# EAGLE design BackscatterPlantSensor_v6_1 (EAGLE 6.4)

## Sheet 1 of 4
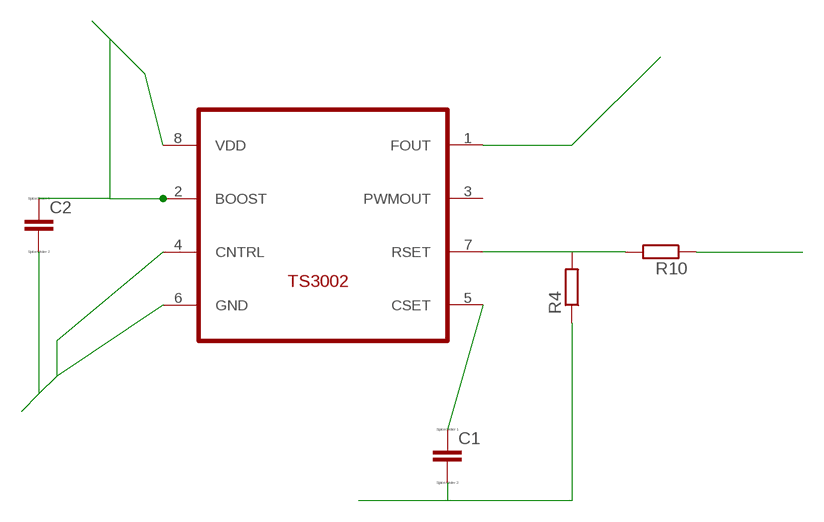
[diagram p0: schematic, sheet 1]

### Parts
C1  CC0603  [C0603]
C2  CC0603  [C0603]
R4  R-EU_R0603  [R0603]
R10  R-EU_R0603  [R0603]
U$1  TS3002  [TDFN22-8]

### Nets
DGND: C1.2 C2.2 R4.1 U$1.4(CNTRL) U$1.6(GND) ; also sheet 3
FOUT: U$1.1(FOUT) ; also sheet 3
N$1: C1.1 U$1.5(CSET)
N$2: R4.2 R10.2 U$1.7(RSET)
VCOND: R10.1 ; also sheet 2
VDD: C2.1 U$1.2(BOOST) U$1.8(VDD) ; also sheet 2,4
Unconnected: U$1.3(PWMOUT)

## Sheet 2 of 4
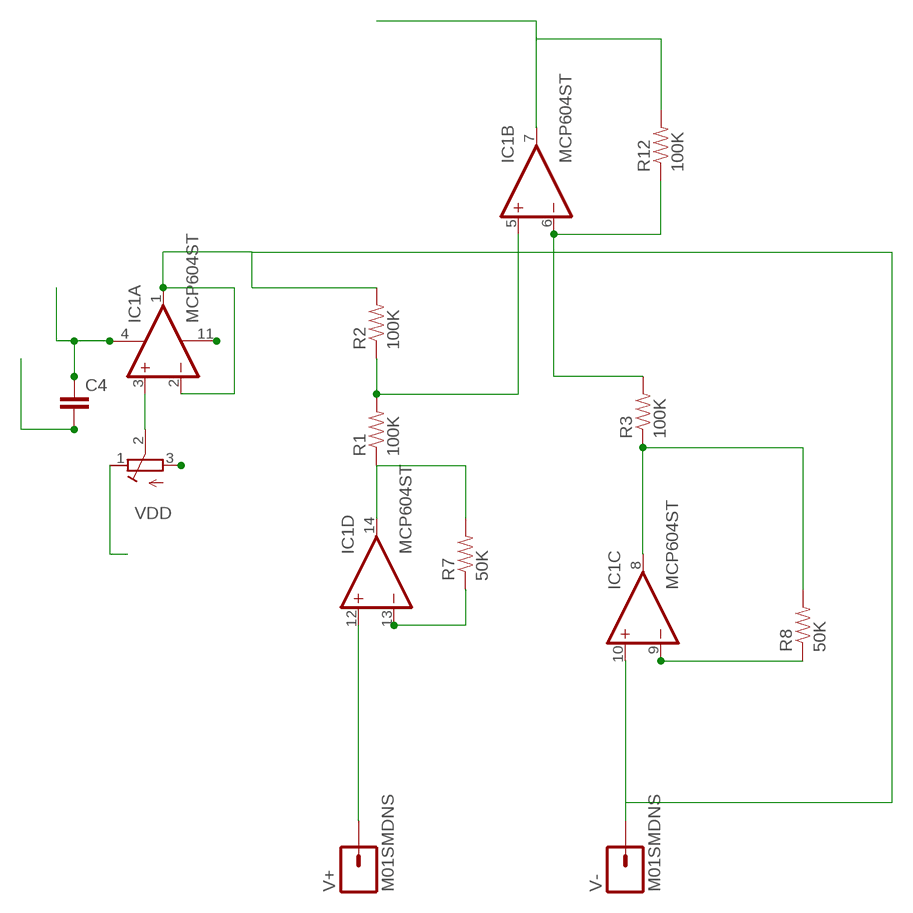
[diagram p1: schematic, sheet 2]

### Parts
C4  CAP0603-CAP  [0603-CAP]
IC1  MCP604ST  [TSSOP14]
R1  100K  RESISTOR  [0805]
R2  100K  RESISTOR  [0805]
R3  100K  RESISTOR  [0805]
R7  50K  RESISTOR  [0805]
R8  50K  RESISTOR  [0805]
R12  100K  RESISTOR  [0805]
V+  M01SMDNS  [1X01NS]
V-  M01SMDNS  [1X01NS]
VDD  R-TRIMM3314G  [RTRIM3314G]

### Nets
AGND: C4.2 IC1.11(P:V-) VDD.3(A)
N$12: IC1.3(A:+IN) VDD.2(S)
N$13: IC1.13(D:-IN) R7.1
N$15: IC1.5(B:+IN) R1.2 R2.1
N$92: IC1.9(C:-IN) R8.1
N$93: IC1.8(C:OUT) R3.1 R8.2
N$96: IC1.14(D:OUT) R1.1 R7.2
N$100: IC1.6(B:-IN) R3.2 R12.1
V+: IC1.12(D:+IN) V+.1
VCOND: IC1.7(B:OUT) R12.2 ; also sheet 1
VDD: C4.1 IC1.4(P:V+) VDD.1(E) ; also sheet 1,4
VRF: IC1.1(A:OUT) IC1.2(A:-IN) IC1.10(C:+IN) R2.2 V-.1

## Sheet 3 of 4
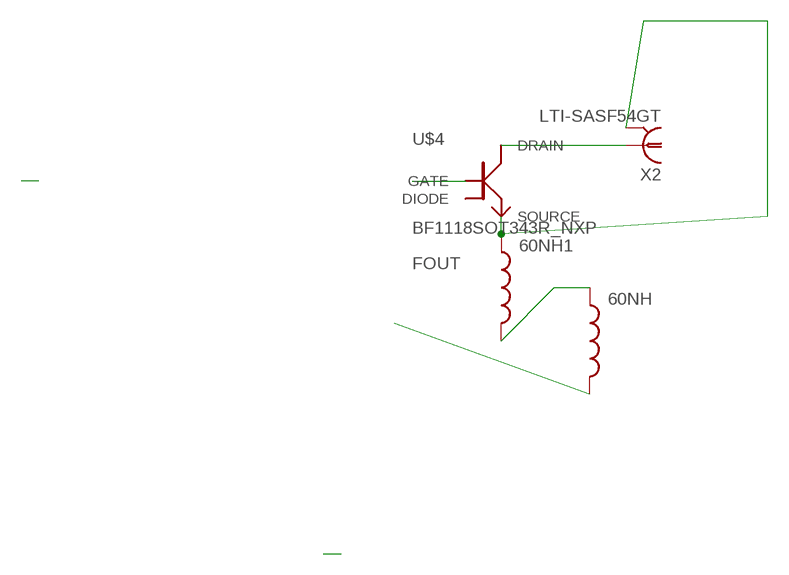
[diagram p2: schematic, sheet 3]

### Parts
60NH  INDUCTOR0402  [C0402]
60NH1  INDUCTOR0402  [C0402]
U$4  BF1118SOT343R_NXP  [SOT343R]
X2  LTI-SASF54GT  [LTI-SASF54GT]

### Nets
DGND: U$4.1(GATE) ; also sheet 1
DRAIN: U$4.4(DRAIN) X2.1
FOUT: 60NH.2 ; also sheet 1
FOUT2: 60NH1.1 U$4.3(SOURCE) X2.2(GND)
N$3: 60NH1.2 60NH.1
Unconnected: U$4.2(DIODE)

## Sheet 4 of 4
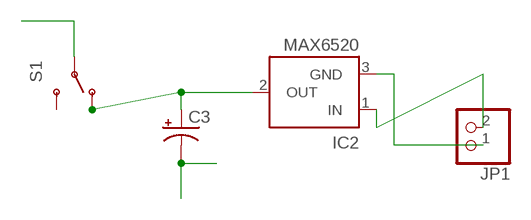
[diagram p3: schematic, sheet 4]

### Parts
C3  CAP_POL1206  [EIA3216]
IC2  MAX6520  [SOT23]
JP1  PINHD-1X2  [1X02]
S1  SWITCH-SPDTPTH  [SWITCH-SPDT]

### Nets
GND: C3.C(-) IC2.3(GND) JP1.1
N$4: IC2.1(IN) JP1.2
N$7: C3.A(+) IC2.2(OUT) S1.1(O)
VDD: S1.2(P) ; also sheet 1,2
Unconnected: S1.3(S)

## Power pins joined to a net without a drawn wire
GND: X2.3(GND) X2.4(GND) X2.5(GND)

## Library data of the parts
60NH 60NH1 = SparkFun:INDUCTOR: Inductors Basic Inductor/Choke - 0603 and 1206. Footprints are not proven and vary greatly between part numbers.
C1 C2 = eagle-ltspice:C: CAPACITOR, European symbol; SPICEMODEL: NONE; SPICEPREFIX: C
C3 = SparkFun-Capacitors:CAP_POL: Capacitor Polarized These are standard SMD and PTH capacitors. Normally 10uF, 47uF, and 100uF in electrolytic and tantalum varieties. Always verify the external diameter of the through hole cap, it varies with capacity, voltage, and manufacturer. The EIA devices should be standard.
C4 = SparkFun-Passives:CAP: Capacitor Standard 0603 ceramic capacitor, and 0.1" leaded capacitor.
IC1 = linear:MCP604: Quad Op Amp 2.7V to 6.0V Single Supply CMOS Source: http://ww1.microchip.com/downloads/en/DeviceDoc/21314g.pdf
IC2 = maxim:MAX6520: 1.2V Voltage Reference 50ppm/°C, SOT23, 3-Terminal Source: Data sheet <http://datasheets.maxim-ic.com/en/ds/MAX6520.pdf>; MF: MAXIM; MPN: MAX6520EUR-T; OC_FARNELL: unknown; OC_NEWARK: 02J4586
JP1 = pinhead:PINHD-1X2: PIN HEADER
R1-R3 R7 R8 R12 = SparkFun:RESISTOR: Resistor Basic schematic elements and footprints for 0603, 1206, and PTH 1/10th watt (small) resistors.
R4 R10 = rcl:R-EU_: RESISTOR, European symbol
S1 = semipassiveTag_library:SWITCH-SPDT: SPST Switch Simple slide switch. Spark Fun Electronics SKU : COM-00102
U$1 = ts3002TDFN22_8pin:TS3002
U$4 = rf_transistors:BF1118
V+ V- = SparkFun-Connectors:M01: Header 1 Standard 1-pin 0.1" header. Use with straight break away headers (SKU : PRT-00116), right angle break away headers (PRT-00553), swiss pins (PRT-00743), machine pins (PRT-00117), and female headers (PRT-00115).
VDD = rcl:R-TRIMM: Trimm resistor
X2 = con-coax:LTI-SASF54GT: SMA vertical PCB thrue hole jack Source: Lighthorse Technologies, inc. SASF54GT.pdf; OC_FARNELL: unknown; OC_NEWARK: unknown

## Board
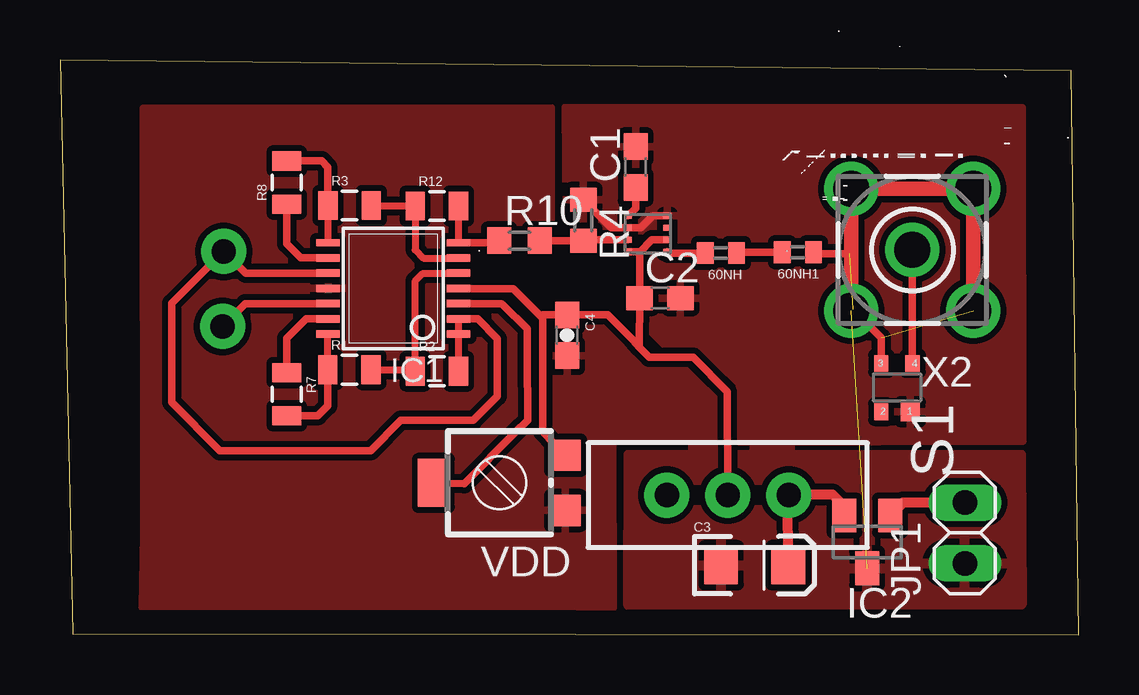
[diagram p4: board, top side]

Size 42.44 x 23.95 mm. Coordinates in mm from the lower left corner, seen from the top.
Outline: 0.53,0.05 42.44,0 42.13,23.5 0,23.95 0.53,0.05
Copper layers (1*16): Top 0.035mm / dielectric 1.5mm / Bottom 0.035mm
Design rules "default *": minimum track width 10mil, minimum drill 24mil, track to track 10mil, track to pad 10mil, pad to pad 10mil, via to via 10mil, smd to smd 10mil, copper to edge 40mil, drill to drill 8mil, minimum pad ring 10mil, minimum via ring 8mil, stop-mask expansion 4mil, vias tented up to drill 0mil, thermal gap 10mil

### Footprints (pad centres in the part's own frame; a part is rotated, then mirrored left to right if it is on the bottom)
C0402 = smd 0.7 x 0.9: 1 -0.65,0; 2 0.65,0
C0603 = smd 1.1 x 1: 1 -0.85,0; 2 0.85,0
EIA3216 = smd 1.4 x 1.6: A 1.4,0; C -1.4,0
0603-CAP = smd 1.1 x 1: 1 -0.85,0; 2 0.85,0
TSSOP14 = smd 0.305 x 0.991: 1 -1.905,-2.718; 2 -1.27,-2.718; 3 -0.635,-2.718; 4 0,-2.718; 5 0.635,-2.718; 6 1.27,-2.718; 7 1.905,-2.718; 8 1.905,2.718; 9 1.27,2.718; 10 0.635,2.718; 11 0,2.718; 12 -0.635,2.718; 13 -1.27,2.718; 14 -1.905,2.718
SOT23 = smd 1 x 1.4: 1 -0.95,-1.1; 2 0.95,-1.1; 3 0,1.1
1X02 = drill 1.016 long: 1 -1.27,0; 2 1.27,0
0805 = smd 0.8 x 1.2: 1 -0.9,0; 2 0.9,0
R0603 = smd 1 x 1.1: 1 -0.85,0; 2 0.85,0
SWITCH-SPDT = drill 1.016 pad 1.88: 1 0,2.54; 2 0,0; 3 0,-2.54
TDFN22-8 = smd 0.35 x 0.25: 1 -1.78,-0.7; 2 -1.78,-1.2; 3 -1.78,-1.7; 4 -1.78,-2.2; 5 -0.13,-2.2; 6 -0.13,-1.7; 7 -0.13,-1.2; 8 -0.13,-0.7
SOT343R = smd 0.8 x 0.8: 1 0.55,-1.07 | smd 0.6 x 0.7: 2 -0.66,-1.07; 3 -0.66,0.94; 4 0.65,0.94
1X01NS = drill 1.016 pad 1.88: 1 0,0
RTRIM3314G = smd 1.3 x 1.3: 1 1.15,-2.75; 3 -1.15,-2.75 | smd 2 x 1.3: 2 0,2.75
LTI-SASF54GT = drill 1.5 pad 2.2: 1 0,0; 2 -2.54,2.54; 3 2.54,2.54; 4 2.54,-2.54; 5 -2.54,-2.54

### Placement (x,y rotation side)
60NH  27.53,15.91 180 top
60NH1  30.74,15.94 180 top
C1  23.99,19.5 90 top
C2  25,14.04 0 top
C3  28.94,2.91 0 top
C4  21.12,12.48 270 top
IC1  13.88,14.44 90 top
IC2  33.63,3.88 180 top
JP1  37.7,4.24 90 top
R1  12.06,11.05 0 top
R2  15.7,10.99 0 top
R3  12.06,17.89 0 top
R4  21.81,17.27 270 top
R7  9.45,10.03 270 top
R8  9.45,18.85 90 top
R10  19.14,16.43 0 top
R12  15.7,17.87 0 top
S1  27.83,5.83 270 top
U$1  23.53,15.26 180 top
U$4  34.88,10.36 0 top
V+  6.77,12.85 0 top
V-  6.82,15.98 270 top
VDD  18.31,6.34 90 top
X2  35.51,16.04 180 top

### Tracks (layer width: path | path; a pad name or v marks a point on that pad's centre or on a via)
AGND
  pour Top: 23.03,8.22 27.75,8.27 27.72,9.4 26.05,11.05 24.66,11.06 23.14,12.58 23.14,15.2 23.02,15.33 20.47,15.33 20.47,21.96 3.46,21.95 3.48,4.2 3.43,1.15 6.17,1.15 23.05,1.13
DGND
  Top 0.305: U$1.4 24.69,17.46 24.2,16.96 U$1.6 22.97,16.96 R4.1
  pour Top: 21.05,21.98 21.11,15.47 24.59,15.4 24.59,12.67 25.16,12.12 26.61,12.12 28.3,10.45 28.27,8.02 40.11,8.06 40.08,21.96
DRAIN
  Top 0.305: U$4.4 35.51,11.79 X2.1
FOUT
  Top 0.305: 60NH.2 25.35,15.91 U$1.1
FOUT2  (2 unrouted)
  Top 0.305: 60NH1.1 31.45,15.88 32.89,15.88 | X2.2 38.06,13.56 | 38.06,18.63 38.05,18.57 | U$4.3 34.22,12.38 33.02,13.58
  Top 0.61: 38.05,18.57 X2.2
GND  (1 unrouted)
  Top 0.61: X2.3 X2.4 X2.5
  pour Top: 23.69,7.52 40.03,7.52 40.06,1.27 23.69,1.23
N$1
  Top 0.305: U$1.5 23.99,17.79 C1.1
N$2
  Top 0.305: R10.2 20.11,16.42 R4.2 22.17,16.46 U$1.7
N$3
  Top 0.305: 60NH1.2 28.21,15.93 60NH.1
N$4
  Top 0.406: JP1.2 35.12,5.52 IC2.1
N$7
  Top 0.406: C3.A 30.31,5.8 S1.1 30.19,5.84 32.19,5.84 32.69,5.35 IC2.2
N$12
  Top 0.3: IC1.3 17.48,13.8
  Top 0.305: IC1.3 16.62,13.8 18.39,13.8 18.45,13.77 19.47,12.74 19.47,11.67 19.48,8.95 18.94,8.41 16.84,6.3 VDD.2
N$13
  Top 0.305: 9.45,10.99 R7.1 9.45,12.35 10.26,13.17 IC1.13
N$14
  pour Top: 27.72,9.02 27.75,7.13 26.33,7.02 26.33,9.01
N$15
  Top 0.3: R2.1 14.8,14.75 15.11,15.06 16.59,15.06 IC1.5
  Top 0.305: R1.2 14.88,11.03 R2.1
N$21
  pour Top: 28.86,7.38 28.94,9.55 30.47,9.55 30.47,7.27 29.09,7.27 29.09,7.3
N$92
  Top 0.305: R8.1 9.45,16.29 10.03,15.71 IC1.9
N$93
  Top 0.3: R3.1 IC1.8
  Top 0.305: IC1.8 | R8.2 10.9,19.75 11.16,19.49 R3.1
N$96
  Top 0.3: R1.1 IC1.14
  Top 0.305: IC1.14 | R7.2 10.75,9.13 11.16,9.55 11.16,10.63 R1.1
N$100
  Top 0.3: R12.1 14.8,16.04 15.14,15.7 IC1.6
  Top 0.305: R3.2 R12.1
V+
  Top 0.305: V+.1 7.72,13.8 IC1.12
VCOND
  Top 0.3: R12.2 IC1.7
  Top 0.305: IC1.7 17.71,16.34 R10.1
VDD
  Top 0.3: 16.62,14.42 IC1.4
  Top 0.305: 16.61,14.45 IC1.4 | 24.15,15.94 C2.1 24.13,11.99 | U$1.8 24.15,15.97 24.15,15.94 | 16.62,14.42 17.8,14.42 | 17.8,14.42 17.84,14.43 | 24.15,15.94 24.66,16.46 U$1.2 | 17.8,14.42 18.84,14.42 18.88,14.42 20.03,13.27 20.11,13.34 | S1.2 27.8,10.13 26.39,11.56 24.55,11.56 24.13,11.99 | 20.11,13.34 C4.1 22.81,13.34 23.83,12.32 24.13,11.99 | 20.11,13.34 20.11,8.46 VDD.1
VRF
  Top 0.3: 16.59,11.05 IC1.1 IC1.2
  Top 0.305: 16.57,10.71 R2.2 16.59,11.05 | IC1.10 7.73,15.07 V-.1 4.66,13.82 4.66,9.7 6.66,7.67 12.95,7.67 14.2,8.94 17.22,8.94 18.22,9.94 18.22,12.34 17.4,13.17 IC1.2